# EAGLE schematic schematic (EAGLE 9.6.2)
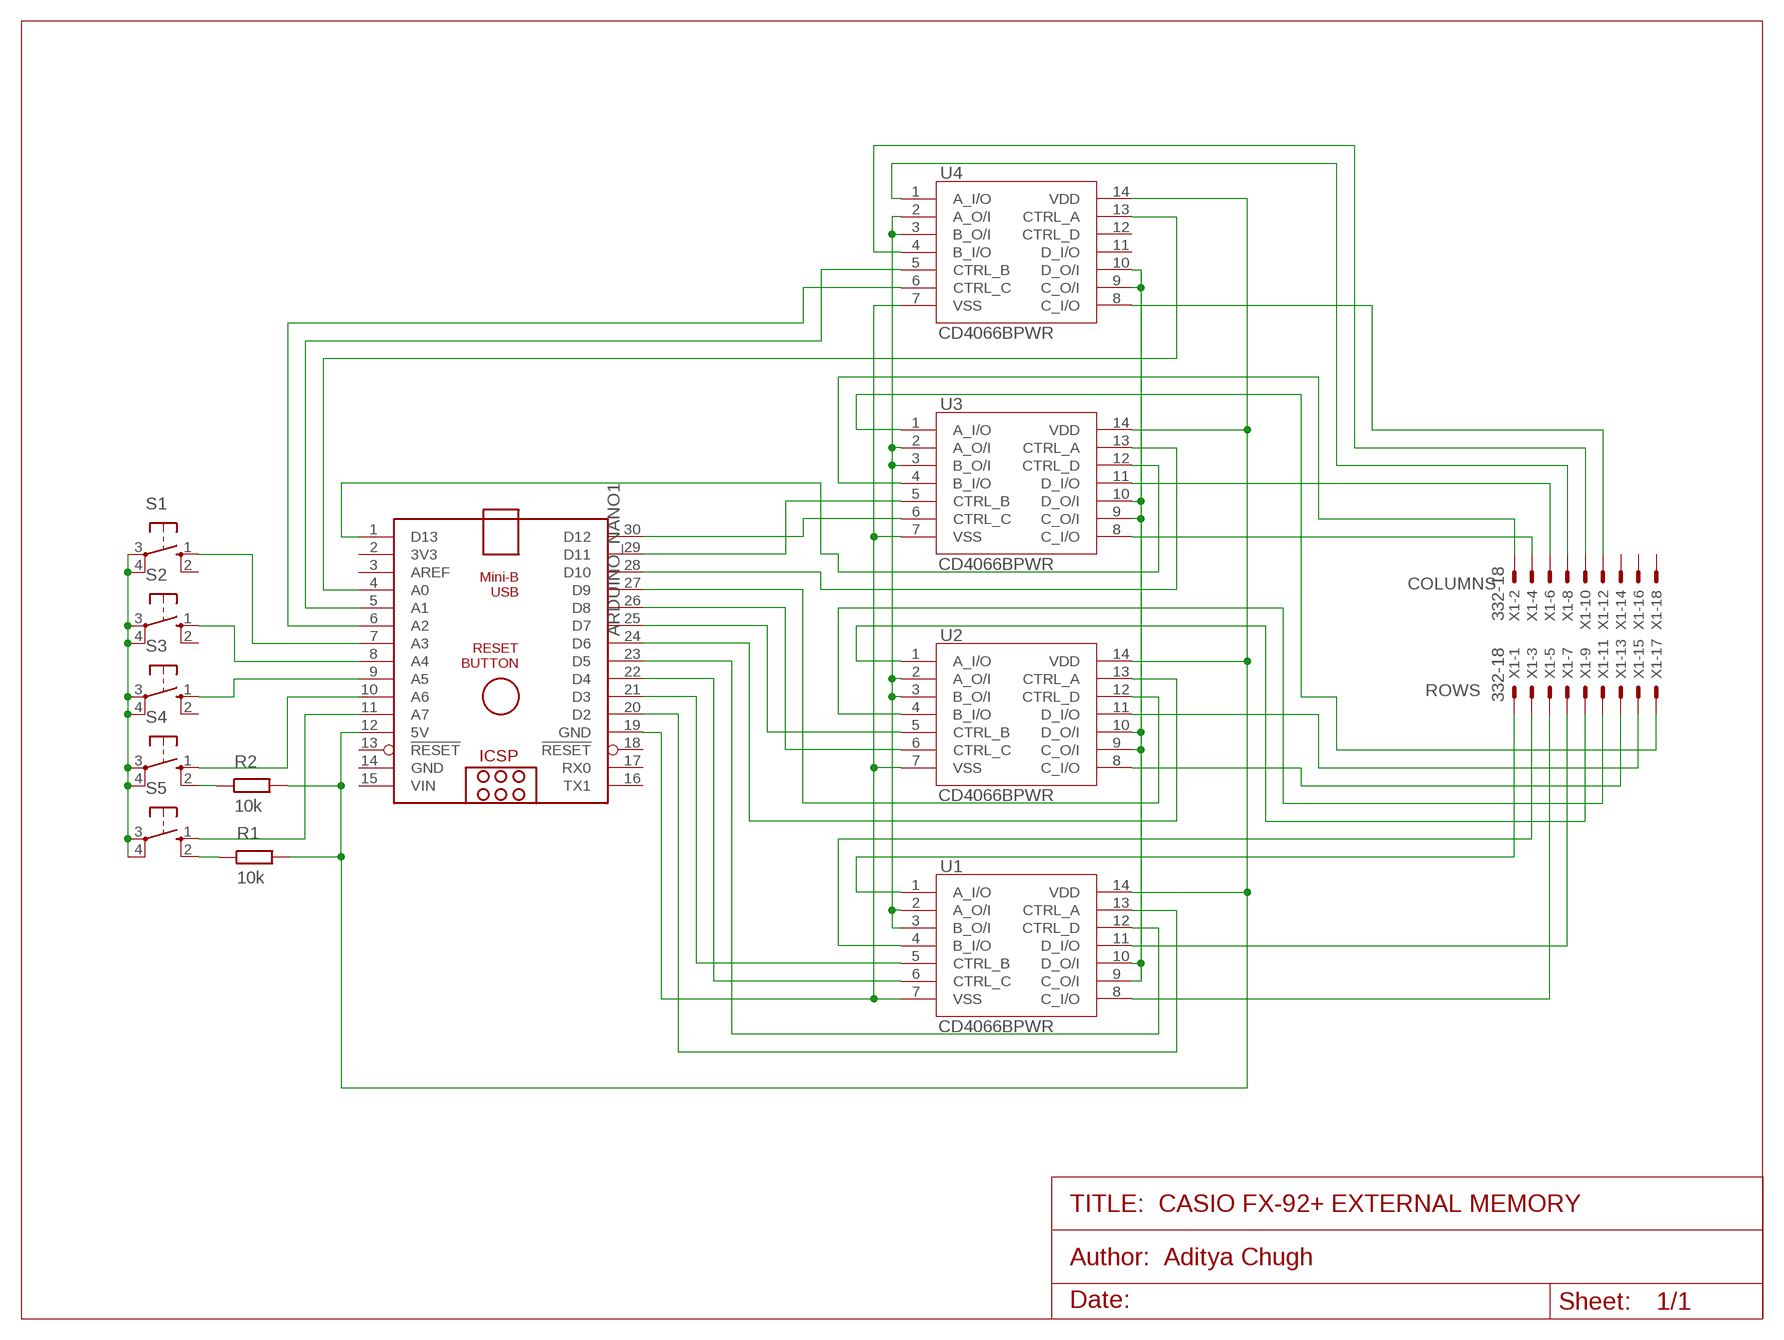
[diagram p0: schematic, sheet 1]

## Parts
ARDUINO_NANO1  ARDUINO_NANO  [ARDUINO_NANO]
R1  10k  R  (no package)
R2  10k  R  (no package)
S1  10-XX  [B3F-10XX]
S2  10-XX  [B3F-10XX]
S3  10-XX  [B3F-10XX]
S4  10-XX  [B3F-10XX]
S5  10-XX  [B3F-10XX]
U1  CD4066BPWR  [TSSOP14]
U2  CD4066BPWR  [TSSOP14]
U3  CD4066BPWR  [TSSOP14]
U4  CD4066BPWR  [TSSOP14]
X1  332-18  [332-18]

## Nets
N$1: ARDUINO_NANO1.11(A7) S5.1(S)
N$2: ARDUINO_NANO1.10(A6) S4.1(S)
N$3: ARDUINO_NANO1.9(A5) S3.1(S)
N$4: ARDUINO_NANO1.8(A4) S2.1(S)
N$5: ARDUINO_NANO1.7(A3) S1.1(S)
N$6: ARDUINO_NANO1.12(5V) R1.2 R2.2 U1.14(VDD) U2.14(VDD) U3.14(VDD) U4.14(VDD)
N$7: R2.1 S4.2(S1)
N$8: R1.1 S5.2(S1)
N$9: S1.3(P) S1.4(P1) S2.3(P) S2.4(P1) S3.3(P) S3.4(P1) S4.3(P) S4.4(P1) S5.3(P) S5.4(P1)
N$10: ARDUINO_NANO1.20(D2) U1.13(CTRL_A)
N$11: ARDUINO_NANO1.21(D3) U1.5(CTRL_B)
N$12: ARDUINO_NANO1.22(D4) U1.6(CTRL_C)
N$13: ARDUINO_NANO1.23(D5) U1.12(CTRL_D)
N$14: U1.9(C_O/I) U1.10(D_O/I) U2.9(C_O/I) U2.10(D_O/I) U3.9(C_O/I) U3.10(D_O/I) U4.9(C_O/I) U4.10(D_O/I)
N$15: U1.2(A_O/I) U1.3(B_O/I) U2.2(A_O/I) U2.3(B_O/I) U3.2(A_O/I) U3.3(B_O/I) U4.2(A_O/I) U4.3(B_O/I)
N$16: ARDUINO_NANO1.24(D6) U2.13(CTRL_A)
N$17: ARDUINO_NANO1.25(D7) U2.5(CTRL_B)
N$18: ARDUINO_NANO1.19(GND) U1.7(VSS) U2.7(VSS) U3.7(VSS) U4.7(VSS)
N$19: ARDUINO_NANO1.26(D8) U2.6(CTRL_C)
N$20: ARDUINO_NANO1.27(D9) U2.12(CTRL_D)
N$21: ARDUINO_NANO1.28(D10) U3.13(CTRL_A)
N$22: ARDUINO_NANO1.29(D11) U3.5(CTRL_B)
N$23: ARDUINO_NANO1.30(D12) U3.6(CTRL_C)
N$24: ARDUINO_NANO1.1(D13) U3.12(CTRL_D)
N$25: ARDUINO_NANO1.4(A0) U4.13(CTRL_A)
N$26: ARDUINO_NANO1.5(A1) U4.5(CTRL_B)
N$27: ARDUINO_NANO1.6(A2) U4.6(CTRL_C)
N$28: U1.1(A_I/O) X1.1
N$29: U1.4(B_I/O) X1.3
N$30: U1.8(C_I/O) X1.5
N$31: U1.11(D_I/O) X1.7
N$32: U2.1(A_I/O) X1.9
N$33: U2.4(B_I/O) X1.11
N$34: U2.11(D_I/O) X1.15
N$35: U3.1(A_I/O) X1.17
N$36: U3.4(B_I/O) X1.2
N$37: U3.8(C_I/O) X1.4
N$38: U3.11(D_I/O) X1.6
N$39: U4.1(A_I/O) X1.8
N$40: U4.4(B_I/O) X1.10
N$41: U4.8(C_I/O) X1.12
N$42: U2.8(C_I/O) X1.13
Unconnected: ARDUINO_NANO1.2(3V3) ARDUINO_NANO1.3(AREF) ARDUINO_NANO1.13(!RESET) ARDUINO_NANO1.16(TX1) ARDUINO_NANO1.17(RX0) ARDUINO_NANO1.18(!RESET) S1.2(S1) S2.2(S1) S3.2(S1) U4.11(D_I/O) U4.12(CTRL_D) X1.14 X1.16 X1.18

## Notes on the sheet
- COLUMNS
- ROWS

## Power pins joined to a net without a drawn wire
GND: ARDUINO_NANO1.14(GND)
VIN: ARDUINO_NANO1.15(VIN)

## Library data of the parts
ARDUINO_NANO1 = ArduinoNanoV30:ARDUINO_NANO: Arduino Nano V3.0 Overview: The Arduino Nano is a small, complete, and breadboard-friendly board based on the ATmega328 (Arduino Nano 3.x) or ATmega168 (Arduino Nano 2.x). It has more or less the same functionality of the Arduino Duemilanove, but in a different package. It lacks only a DC power jack, and works with a Mini-B USB cable instead of a standard one. The Nano was designed and is being produced by Gravitech. Specifications: Microcontroller Atmel ATmega168 or ATmega328 Operating Voltage (logic level) 5 V Input Voltage (recommended) 7-12 V Input Voltage (limits) 6-20 V Digital I/O Pins 14 (of which 6 provide PWM output) Analog Input Pins 8 DC Current per I/O Pin 40 mA Flash Memory 16 KB (ATmega168) or 32 KB (ATmega328) of which 2 KB used by bootloader SRAM 1 KB (ATmega168) or 2 KB (ATmega328) EEPROM 512 bytes (ATmega168) or 1 KB (ATmega328) Clock Speed 16 MHz Dimensions 0.73" x 1.70" Length 45 mm Width 18 mm Weigth 5 g Power: The Arduino Nano can be powered via the Mini-B USB connection, 6-20V unregulated external power supply (pin 30), or 5V regulated external power supply (pin 27). The power source is automatically selected to the highest voltage source. Memory: The ATmega168 has 16 KB of flash memory for storing code (of which 2 KB is used for the bootloader); the ATmega328 has 32 KB, (also with 2 KB used for the bootloader). The ATmega168 has 1 KB of SRAM and 512 bytes of EEPROM (which can be read and written with the EEPROM library); the ATmega328 has 2 KB of SRAM and 1 KB of EEPROM. Input and Output: Each of the 14 digital pins on the Nano can be used as an input or output, using pinMode(), digitalWrite(), and digitalRead() functions. They operate at 5 volts. Each pin can provide or receive a maximum of 40 mA and has an internal pull-up resistor (disconnected by default) of 20-50 kOhms. In addition, some pins have specialized functions. Visit Arduino - ArduinoBoardNano <https://www.arduino.cc/en/Main/ArduinoBoardNano>
R1 R2 = ngspice-simulation:R: RESISTOR
S1-S5 = switch-omron:10-XX: OMRON SWITCH; MPN: B3F-1000; OC_FARNELL: 176432; OC_NEWARK: 36M3542
U1-U4 = IC-local:CD4066BPWR: Bilateral switch IC for controlling data lines. Vss should normally be connected to GND. https://www.digikey.com/product-detail/en/texas-instruments/CD4066BPWR/296-14123-2-ND/525930; DKPN: 296-14123-1-ND
X1 = con-garry:332-18: 18 Pin - 2mm Dual Row Source: www.mpe-connector.de / garry_shortform_2012.pdf